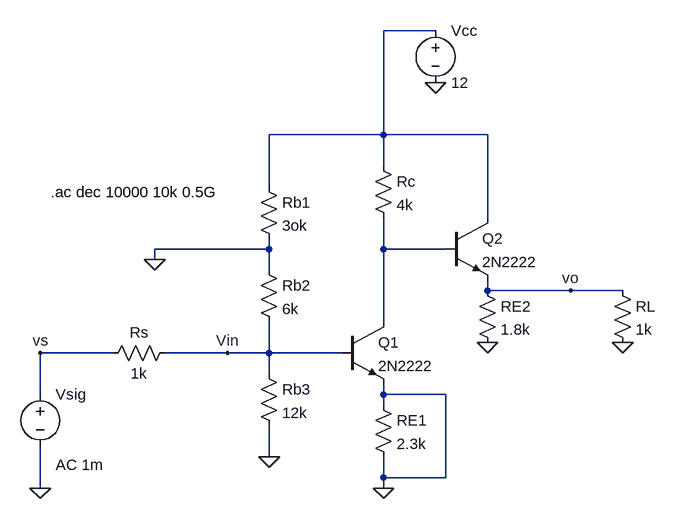
[diagram p0: schematic ask4.asc]
ask4.asc, the LTspice schematic file:
Version 4
SHEET 1 1332 680
WIRE 560 -384 480 -384
WIRE 480 -224 480 -384
WIRE 480 -224 304 -224
WIRE 640 -224 480 -224
WIRE 480 -176 480 -224
WIRE 304 -144 304 -224
WIRE 640 -96 640 -224
WIRE 304 -48 304 -64
WIRE 304 -48 128 -48
WIRE 480 -48 480 -96
WIRE 576 -48 480 -48
WIRE 128 -32 128 -48
WIRE 304 -16 304 -48
WIRE 640 16 640 0
WIRE 768 16 640 16
WIRE 848 16 768 16
WIRE 480 64 480 -48
WIRE 64 112 -48 112
WIRE 240 112 144 112
WIRE 304 112 304 64
WIRE 304 112 240 112
WIRE 416 112 304 112
WIRE 304 144 304 112
WIRE -48 176 -48 112
WIRE 480 176 480 160
WIRE 576 176 480 176
WIRE 480 192 480 176
WIRE 304 272 304 224
WIRE 480 304 480 272
WIRE 576 304 576 176
WIRE 576 304 480 304
WIRE -48 320 -48 256
WIRE 480 320 480 304
FLAG 304 272 0
FLAG 128 -32 0
FLAG 480 320 0
FLAG 640 96 0
FLAG 848 96 0
FLAG 560 -304 0
FLAG -48 320 0
FLAG 768 16 vo
FLAG -48 112 vs
FLAG 240 112 Vin
SYMBOL res 160 96 R90
WINDOW 0 0 56 VBottom 2
WINDOW 3 32 56 VTop 2
SYMATTR InstName Rs
SYMATTR Value 1k
SYMBOL res 288 128 R0
SYMATTR InstName Rb3
SYMATTR Value 12k
SYMBOL res 288 -32 R0
SYMATTR InstName Rb2
SYMATTR Value 6k
SYMBOL res 288 -160 R0
SYMATTR InstName Rb1
SYMATTR Value 3ok
SYMBOL npn 416 64 R0
SYMATTR InstName Q1
SYMATTR Value 2N2222
SYMBOL res 464 176 R0
SYMATTR InstName RE1
SYMATTR Value 2.3k
SYMBOL res 464 -192 R0
SYMATTR InstName Rc
SYMATTR Value 4k
SYMBOL npn 576 -96 R0
SYMATTR InstName Q2
SYMATTR Value 2N2222
SYMBOL res 624 0 R0
SYMATTR InstName RE2
SYMATTR Value 1.8k
SYMBOL res 832 0 R0
SYMATTR InstName RL
SYMATTR Value 1k
SYMBOL voltage 560 -400 R0
SYMATTR InstName Vcc
SYMATTR Value 12
SYMBOL voltage -48 160 R0
WINDOW 3 24 96 Invisible 2
WINDOW 123 24 124 Left 2
WINDOW 39 0 0 Left 0
SYMATTR Value 0
SYMATTR Value2 AC 1m
SYMATTR InstName Vsig
TEXT -32 -136 Left 2 !.ac dec 10000 10k 0.5G

The netlist it stands for:
* ask4.asc
Rs Vin vs 1k
Rb3 Vin 0 12k
Rb2 0 Vin 6k
Rb1 N001 0 3ok
Q1 N002 Vin 0 0 2N2222
RE1 0 0 2.3k
Rc N001 N002 4k
Q2 N001 N002 vo 0 2N2222
RE2 vo 0 1.8k
RL vo 0 1k
Vcc N001 0 12
Vsig vs 0 0 AC 1m
.model NPN NPN
.model PNP PNP
.lib standard.bjt
.ac dec 10000 10k 0.5G
.backanno
.end